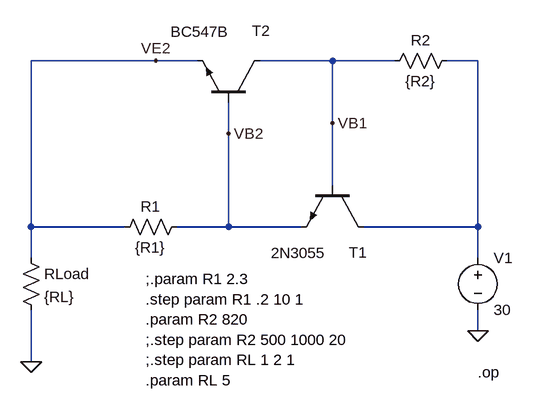
[diagram p0: schematic electronicFuse01.asc]
electronicFuse01.asc, the LTspice schematic file:
Version 4.1
SHEET 1 880 680
WIRE -128 -16 -320 -16
WIRE -64 -16 -128 -16
WIRE 144 -16 32 -16
WIRE 240 -16 144 -16
WIRE 368 -16 320 -16
WIRE 144 80 144 -16
WIRE -16 96 -16 48
WIRE 144 176 144 80
WIRE -320 240 -320 -16
WIRE -176 240 -320 240
WIRE -16 240 -16 96
WIRE -16 240 -96 240
WIRE 96 240 -16 240
WIRE 368 240 368 -16
WIRE 368 240 192 240
WIRE -320 288 -320 240
WIRE 368 288 368 240
WIRE 368 400 368 368
WIRE -320 448 -320 368
FLAG -320 448 0
FLAG 368 400 0
FLAG 144 80 VB1
FLAG -16 96 VB2
FLAG -128 -16 VE2
SYMBOL npn 192 176 R90
WINDOW 0 103 -6 VRight 2
WINDOW 3 104 58 VRight 2
SYMATTR InstName T1
SYMATTR Value 2N3055
SYMBOL npn 32 48 M270
WINDOW 0 110 12 VLeft 2
WINDOW 3 109 137 VLeft 2
SYMATTR InstName T2
SYMATTR Value BC547B
SYMBOL res 336 -32 R90
WINDOW 0 0 56 VBottom 2
WINDOW 3 32 56 VTop 2
SYMATTR InstName R2
SYMATTR Value {R2}
SYMBOL res -80 224 R90
WINDOW 0 0 56 VBottom 2
WINDOW 3 32 56 VTop 2
SYMATTR InstName R1
SYMATTR Value {R1}
SYMBOL voltage 368 272 R0
WINDOW 123 0 0 Left 0
WINDOW 39 0 0 Left 0
SYMATTR InstName V1
SYMATTR Value 30
SYMBOL res -336 272 R0
SYMATTR InstName RLoad
SYMATTR Value {RL}
TEXT 368 464 Left 2 !.op
TEXT -144 320 Left 2 !;.param R1 2.3\n.step param R1 .2 10 1\n.param R2 820\n;.step param R2 500 1000 20\n;.step param RL 1 2 1\n.param RL 5

The netlist it stands for:
* electronicFuse01.asc
Q§T1 N001 VB1 VB2 0 2N3055
Q§T2 VB1 VB2 VE2 0 BC547B
R2 N001 VB1 {R2}
R1 VB2 VE2 {R1}
V1 N001 0 30
RLoad VE2 0 {RL}
.model NPN NPN
.model PNP PNP
.lib standard.bjt
.op
;.param R1 2.3
.step param R1 .2 10 1
.param R2 820
;.step param R2 500 1000 20
;.step param RL 1 2 1
.param RL 5
.backanno
.end